# EAGLE design ARE_entrenadora_revisada (EAGLE 5.10)
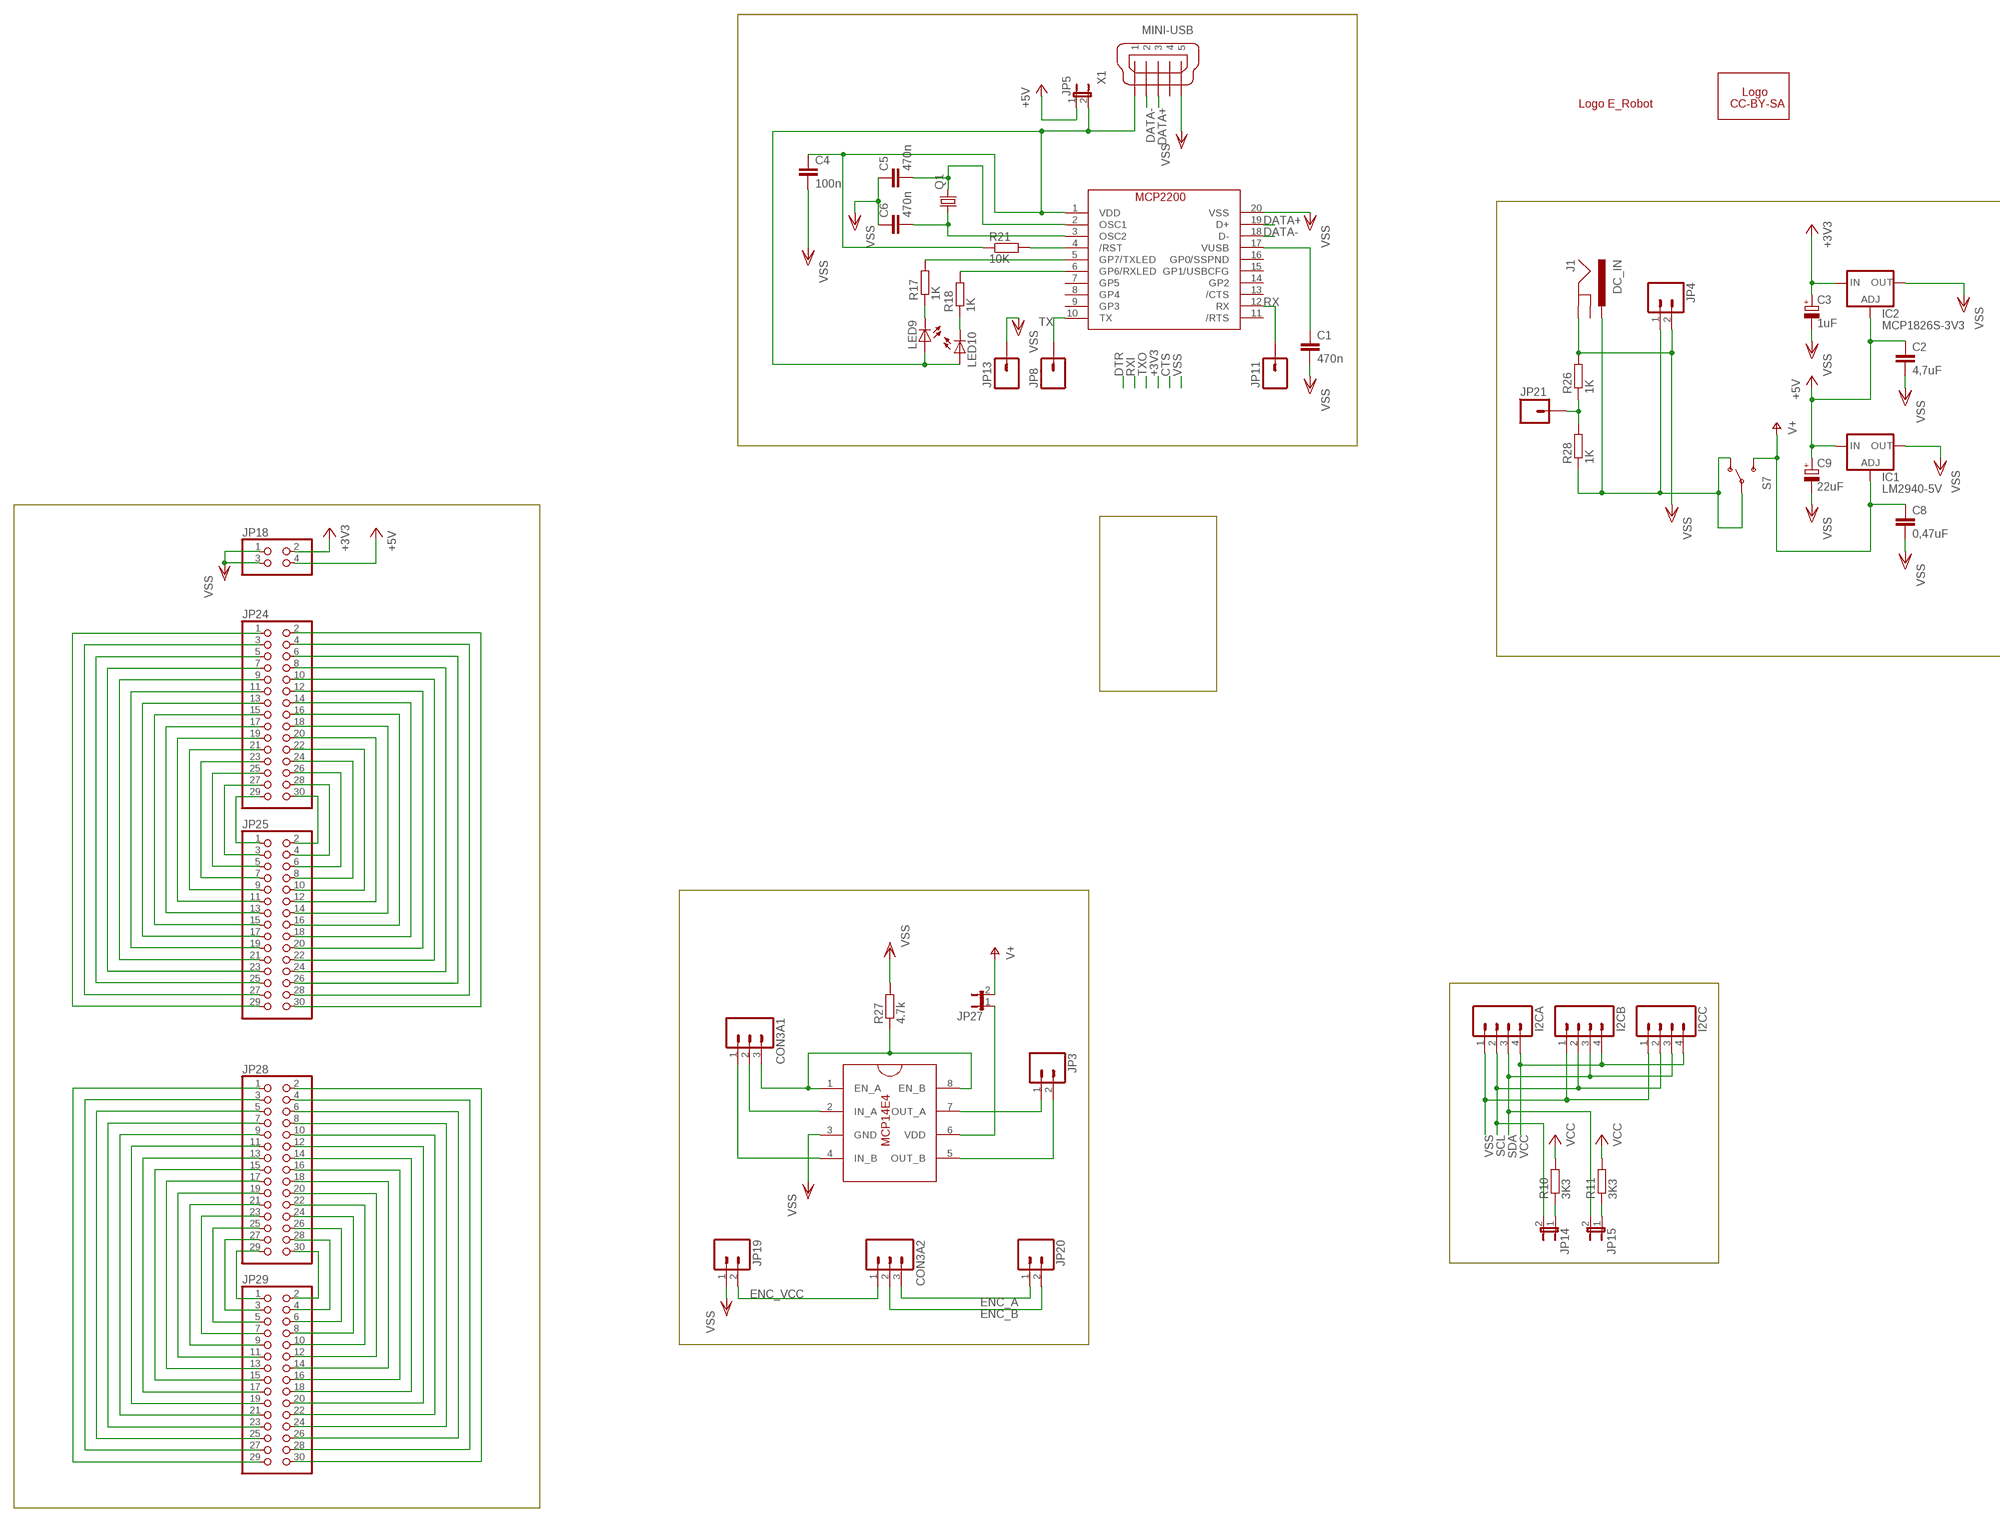
[diagram p0: schematic, sheet 1, part 1 of 2]
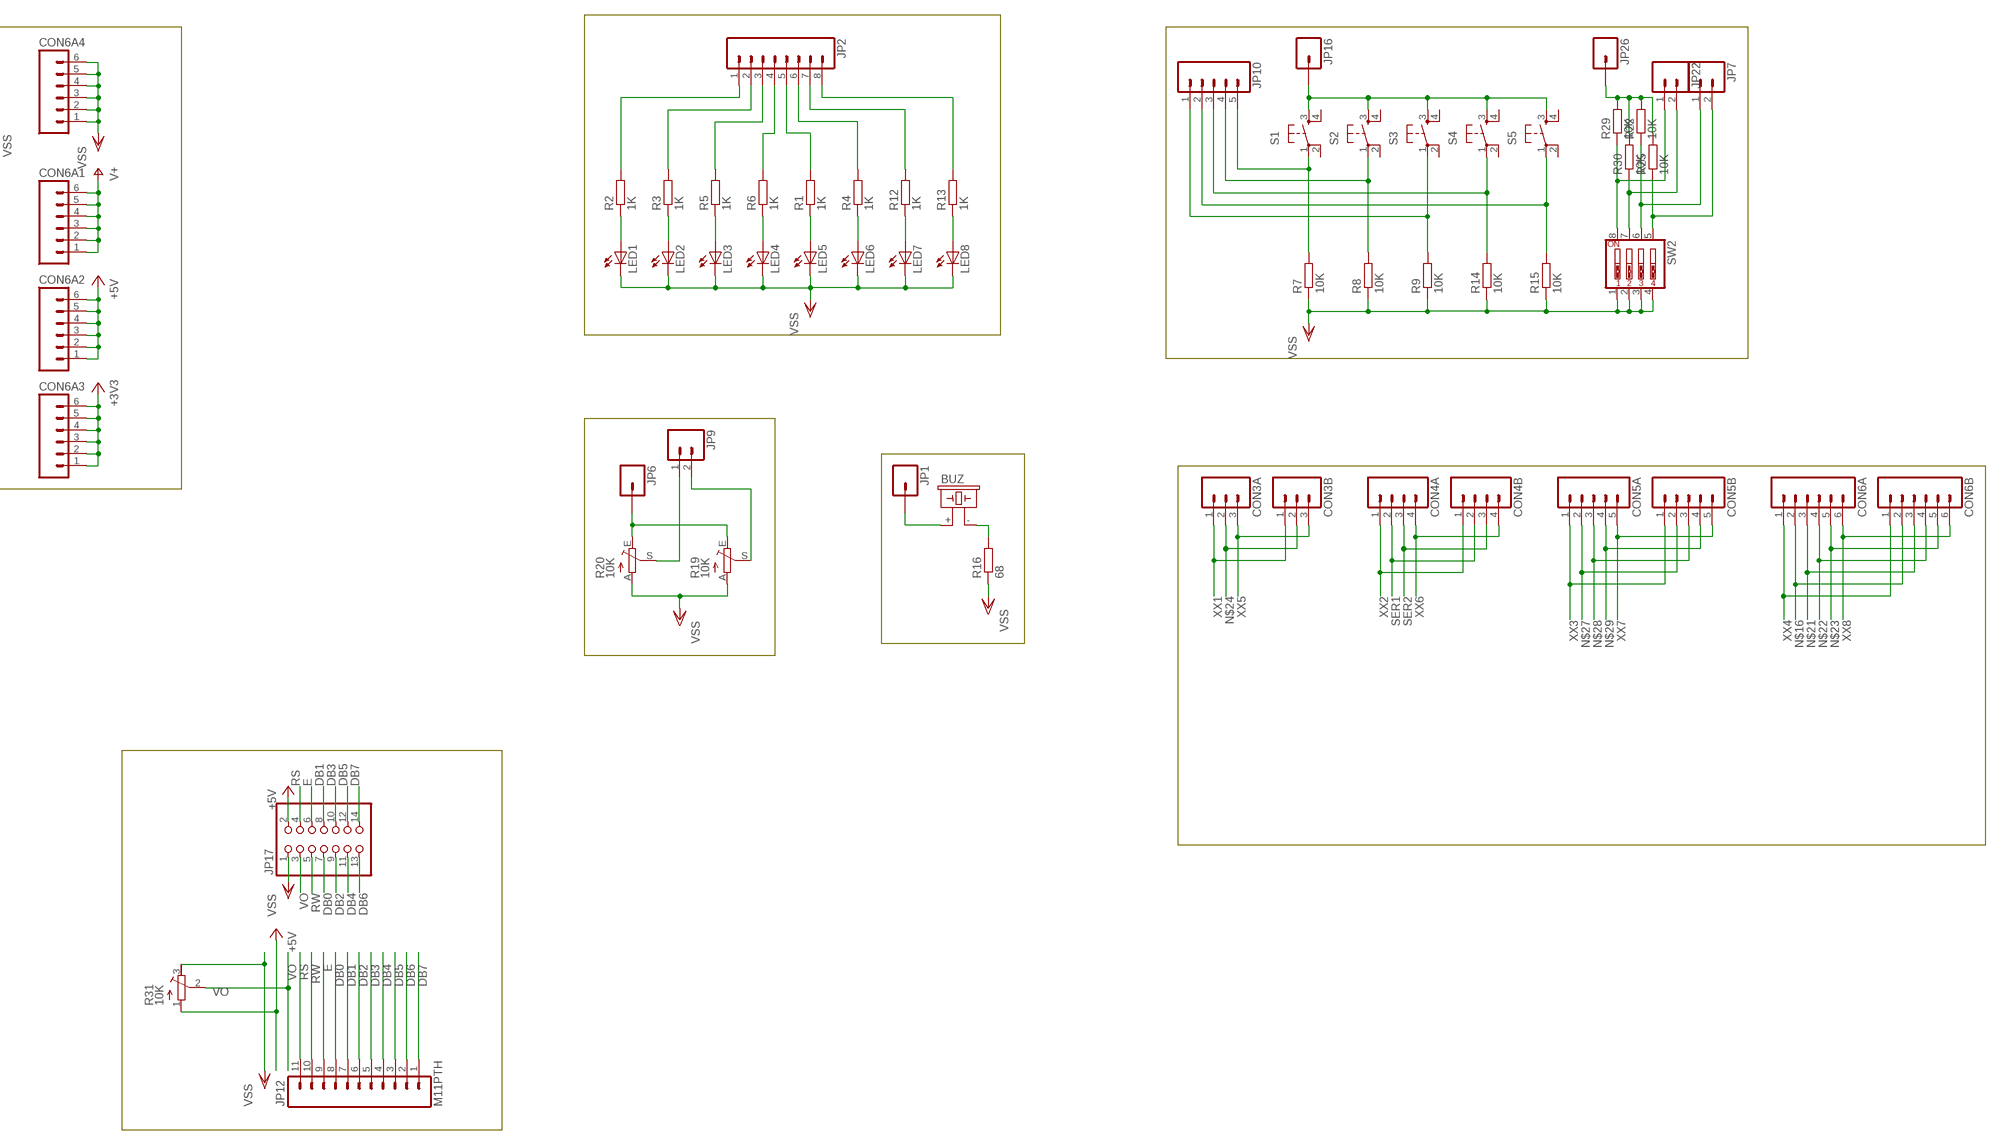
[diagram p1: schematic, sheet 1, part 2 of 2]

## Parts
BUZ  F/CM12P  [F/CM12P]
C1  470n  C-EUC0805  [C0805]
C2  4,7uF  C-EU025-025X050  [C025-025X050]
C3  1uF  CPOL-EUE2,5-6E  [E2,5-6E]
C4  100n  C-EUC0805  [C0805]
C5  470n  C-EUC0805  [C0805]
C6  470n  C-EUC0805  [C0805]
C8  0,47uF  C-EU025-025X050  [C025-025X050]
C9  22uF  CPOL-EUE2,5-6E  [E2,5-6E]
CON3A  M03PTH  [1X03]
CON3A1  M03PTH  [1X03]
CON3A2  M03PTH  [1X03]
CON3B  M03PTH  [1X03]
CON4A  M04PTH  [1X04]
CON4B  M04PTH  [1X04]
CON5A  M05PTH  [1X05]
CON5B  M05PTH  [1X05]
CON6A  M06SIP  [1X06]
CON6A1  M06SIP  [1X06]
CON6A2  M06SIP  [1X06]
CON6A3  M06SIP  [1X06]
CON6A4  M06SIP  [1X06]
CON6B  M06SIP  [1X06]
I2CA  M04PTH  [1X04]
I2CB  M04PTH  [1X04]
I2CC  M04PTH  [1X04]
IC1  LM2940-5V  LM317BD2T  [D2PACK]
IC2  MCP1826S-3V3  LM317BD2T  [D2PACK]
J1  DC_IN  POWER_JACKPTH  [POWER_JACK_PTH]
JP1  M01PTH  [1X01]
JP2  M08  [1X08]
JP3  M02PTH  [1X02]
JP4  M02PTH  [1X02]
JP5  JUMPER-2PTH  [1X02]
JP6  M01PTH  [1X01]
JP7  M02PTH  [1X02]
JP8  M01PTH  [1X01]
JP9  M02PTH  [1X02]
JP10  M05PTH  [1X05]
JP11  M01PTH  [1X01]
JP12  M11PTH  [1X11]
JP13  M01PTH  [1X01]
JP14  JUMPER-2PTH  [1X02]
JP15  JUMPER-2PTH  [1X02]
JP16  M01PTH  [1X01]
JP17  PINHD-2X7  [2X07]
JP18  PINHD-2X2  [2X02]
JP19  M02PTH  [1X02]
JP20  M02PTH  [1X02]
JP21  M01PTH  [1X01]
JP22  M02PTH  [1X02]
JP24  PINHD-2X15  [2X15]
JP25  PINHD-2X15  [2X15]
JP26  M01PTH  [1X01]
JP27  JUMPER-2PTH  [1X02]
JP28  PINHD-2X15  [2X15]
JP29  PINHD-2X15  [2X15]
LED1  LED3MM  [LED3MM]
LED2  LED3MM  [LED3MM]
LED3  LED3MM  [LED3MM]
LED4  LED3MM  [LED3MM]
LED5  LED3MM  [LED3MM]
LED6  LED3MM  [LED3MM]
LED7  LED3MM  [LED3MM]
LED8  LED3MM  [LED3MM]
LED9  LEDCHIPLED_0805  [CHIPLED_0805]
LED10  LEDCHIPLED_0805  [CHIPLED_0805]
Q1  CRYSTALHC18U-V  [HC18U-V]
R1  1K  R-EU_R0805  [R0805]
R2  1K  R-EU_R0805  [R0805]
R3  1K  R-EU_R0805  [R0805]
R4  1K  R-EU_R0805  [R0805]
R5  1K  R-EU_R0805  [R0805]
R6  1K  R-EU_R0805  [R0805]
R7  10K  R-EU_R0805  [R0805]
R8  10K  R-EU_R0805  [R0805]
R9  10K  R-EU_R0805  [R0805]
R10  3K3  R-EU_R0805  [R0805]
R11  3K3  R-EU_R0805  [R0805]
R12  1K  R-EU_R0805  [R0805]
R13  1K  R-EU_R0805  [R0805]
R14  10K  R-EU_R0805  [R0805]
R15  10K  R-EU_R0805  [R0805]
R16  68  R-EU_R0805  [R0805]
R17  1K  R-EU_R0805  [R0805]
R18  1K  R-EU_R0805  [R0805]
R19  10K  TRIM_EU-CA6V  [CA6V]
R20  10K  TRIM_EU-CA6V  [CA6V]
R21  10K  R-EU_R0805  [R0805]
R22  10K  R-EU_R0805  [R0805]
R25  10K  R-EU_R0805  [R0805]
R26  1K  R-EU_R0805  [R0805]
R27  4.7k  R-EU_R0805  [R0805]
R28  1K  R-EU_R0805  [R0805]
R29  10K  R-EU_R0805  [R0805]
R30  10K  R-EU_R0805  [R0805]
R31  10K  R-TRIMM4G/J  [RTRIM4G/J]
S1  TAC_SWITCHPTH  [TACTILE-PTH]
S2  TAC_SWITCHPTH  [TACTILE-PTH]
S3  TAC_SWITCHPTH  [TACTILE-PTH]
S4  TAC_SWITCHPTH  [TACTILE-PTH]
S5  TAC_SWITCHPTH  [TACTILE-PTH]
S7  SWITCH-SPSTSMD2  [SWITCH-SPDT-SMD]
SW2  SW_DIP-4  [EDG-04]
U$1  LOGO_BY-SA  [LOGO_CC-BY-SA]
U$4  MCP14E4P  [DIL8]
U$5  LOGO_E_ROBOTGRANDE_BUTON  [GRANDE]
U$6  MCP2200SO  [SO-20W]
X1  MINI-USB  MINI-USB-32005-201  [32005-201]

## Nets
+3V3: C3.+ CON6A3.1 CON6A3.2 CON6A3.3 CON6A3.4 CON6A3.5 CON6A3.6 IC2.3(IN) JP18.2
+5V: C2.1 C9.+ CON6A2.1 CON6A2.2 CON6A2.3 CON6A2.4 CON6A2.5 CON6A2.6 IC1.3(IN) IC2.1(ADJ) JP5.1 JP17.2 JP18.4 R31.1(E)
DATA+: U$6.19(D+) X1.3
DATA-: U$6.18(D-) X1.2
DB0: JP12.8 JP17.7
DB1: JP12.7 JP17.8
DB2: JP12.6 JP17.9
DB3: JP12.5 JP17.10
DB4: JP12.4 JP17.11
DB5: JP12.3 JP17.12
DB6: JP12.2 JP17.13
DB7: JP12.1 JP17.14
E: JP12.9 JP17.6
ENC_A: CON3A2.3 JP20.1
ENC_B: CON3A2.2 JP20.2
ENC_VCC: CON3A2.1 JP19.2
N$1: LED3.A R5.1
N$2: LED2.A R3.1
N$3: LED1.A R2.1
N$4: LED4.A R6.1
N$5: JP2.2 R3.2
N$6: JP2.3 R5.2
N$7: JP2.1 R2.2
N$8: JP2.4 R6.2
N$9: LED9.C R17.1
N$10: JP10.5 R7.2 S1.1
N$11: JP10.4 R8.2 S2.1
N$12: JP10.3 R14.2 S4.1
N$13: JP14.1 R10.1
N$14: JP15.1 R11.1
N$15: JP6.1 R19.E R20.E
N$16: CON6A.2 CON6B.2
N$17: BUZ.- R16.2
N$18: C6.2 Q1.1 U$6.3(OSC2)
N$19: C5.2 Q1.2 U$6.2(OSC1)
N$20: LED10.C R18.1
N$21: CON6A.3 CON6B.3
N$22: CON6A.4 CON6B.4
N$23: CON6A.5 CON6B.5
N$24: CON3A.2 CON3B.2
N$25: C4.1 JP5.2 LED9.A LED10.A R21.1 U$6.1(VDD) X1.1
N$26: JP16.1 S1.3 S2.3 S3.3 S4.3 S5.3
N$27: CON5A.2 CON5B.2
N$28: CON5A.3 CON5B.3
N$29: CON5A.4 CON5B.4
N$30: JP28.29 JP29.1
N$31: JP28.27 JP29.3
N$32: JP28.25 JP29.5
N$33: JP28.23 JP29.7
N$34: JP28.21 JP29.9
N$35: JP28.19 JP29.11
N$36: JP28.17 JP29.13
N$37: JP28.15 JP29.15
N$38: JP28.13 JP29.17
N$39: JP28.11 JP29.19
N$40: JP28.9 JP29.21
N$41: JP28.7 JP29.23
N$42: JP28.5 JP29.25
N$43: JP28.3 JP29.27
N$44: JP26.1 R22.2 R25.2 R29.2 R30.2
N$45: J1.PWR JP4.1 R28.1 S7.1(O) S7.2(P)
N$46: JP28.30 JP29.2
N$47: JP28.28 JP29.4
N$48: JP28.26 JP29.6
N$49: JP28.24 JP29.8
N$50: R17.2 U$6.5(GP7/TXLED)
N$51: R18.2 U$6.6(GP6/RXLED)
N$52: C1.1 U$6.17(VUSB)
N$53: JP9.1 R20.S
N$54: JP9.2 R19.S
N$55: JP3.1 U$4.7(OUT_A)
N$56: R21.2 U$6.4(/RST)
N$57: JP21.1 R26.1 R28.2
N$58: LED6.A R4.1
N$59: LED5.A R1.1
N$60: LED7.A R12.1
N$61: LED8.A R13.1
N$62: JP2.6 R4.2
N$63: JP2.7 R12.2
N$64: JP2.5 R1.2
N$65: JP2.8 R13.2
N$66: JP10.2 R15.2 S5.1
N$67: JP10.1 R9.2 S3.1
N$68: JP27.1 U$4.6(VDD)
N$69: JP7.2 R25.1 SW2.5
N$70: JP7.1 R22.1 SW2.6
N$71: JP28.1 JP29.29
N$72: JP28.2 JP29.30
N$82: JP28.22 JP29.10
N$83: BUZ.+ JP1.1
N$85: JP28.20 JP29.12
N$86: JP28.18 JP29.14
N$87: JP28.16 JP29.16
N$88: JP28.14 JP29.18
N$89: JP28.12 JP29.20
N$90: JP28.10 JP29.22
N$91: JP28.8 JP29.24
N$92: JP28.6 JP29.26
N$93: JP28.4 JP29.28
N$96: JP24.30 JP25.2
N$97: JP24.28 JP25.4
N$98: JP24.26 JP25.6
N$99: JP24.24 JP25.8
N$100: JP24.22 JP25.10
N$101: JP24.20 JP25.12
N$102: JP24.18 JP25.14
N$103: JP24.16 JP25.16
N$104: JP24.14 JP25.18
N$105: JP24.12 JP25.20
N$106: JP24.10 JP25.22
N$107: JP24.8 JP25.24
N$108: JP24.6 JP25.26
N$109: JP24.4 JP25.28
N$110: JP24.2 JP25.30
N$112: JP24.29 JP25.1
N$113: JP24.27 JP25.3
N$114: JP24.25 JP25.5
N$115: JP24.23 JP25.7
N$116: JP24.21 JP25.9
N$117: JP24.19 JP25.11
N$118: JP24.17 JP25.13
N$119: JP24.15 JP25.15
N$120: JP24.13 JP25.17
N$121: JP24.11 JP25.19
N$122: JP24.9 JP25.21
N$123: JP24.7 JP25.23
N$124: JP24.5 JP25.25
N$125: JP24.3 JP25.27
N$126: JP24.1 JP25.29
N$128: JP3.2 U$4.5(OUT_B)
N$129: CON3A1.3 R27.1 U$4.1(EN_A) U$4.8(EN_B)
N$130: CON3A1.2 U$4.2(IN_A)
N$131: CON3A1.1 U$4.4(IN_B)
N$133: JP22.1 R29.1 SW2.8
N$136: JP22.2 R30.1 SW2.7
RS: JP12.11 JP17.4
RW: JP12.10 JP17.5
RX: JP11.1 U$6.12(RX)
SCL: I2CA.2 I2CB.2 I2CC.2 JP14.2
SDA: I2CA.3 I2CB.3 I2CC.3 JP15.2
SER1: CON4A.2 CON4B.2
SER2: CON4A.3 CON4B.3
TX: JP8.1 U$6.10(TX)
V+: C8.1 CON6A1.1 CON6A1.2 CON6A1.3 CON6A1.4 CON6A1.5 CON6A1.6 IC1.1(ADJ) JP27.2 S7.3(S)
VCC: I2CA.4 I2CB.4 I2CC.4 R10.2 R11.2
VO: JP17.3 R31.2(S)
VSS: C1.2 C2.2 C3.- C4.2 C5.1 C6.1 C8.2 C9.- CON6A4.1 CON6A4.2 CON6A4.3 CON6A4.4 CON6A4.5 CON6A4.6 I2CA.1 I2CB.1 I2CC.1 IC1.2(OUT) IC2.2(OUT) J1.GND JP4.2 JP13.1 JP17.1 JP18.1 JP18.3 JP19.1 LED1.K(C) LED2.K(C) LED3.K(C) LED4.K(C) LED5.K(C) LED6.K(C) LED7.K(C) LED8.K(C) R7.1 R8.1 R9.1 R14.1 R15.1 R16.1 R19.A R20.A R26.2 R27.2 R31.3(A) SW2.1 SW2.2 SW2.3 SW2.4 U$4.3(GND) U$6.20(VSS) X1.5
XX1: CON3A.1 CON3B.1
XX2: CON4A.1 CON4B.1
XX3: CON5A.1 CON5B.1
XX4: CON6A.1 CON6B.1
XX5: CON3A.3 CON3B.3
XX6: CON4A.4 CON4B.4
XX7: CON5A.5 CON5B.5
XX8: CON6A.6 CON6B.6
Unconnected: J1.GNDBREAK S1.2 S1.4 S2.2 S2.4 S3.2 S3.4 S4.2 S4.4 S5.2 S5.4 U$6.7(GP5) U$6.8(GP4) U$6.9(GP3) U$6.11(/RTS) U$6.13(/CTS) U$6.14(GP2) U$6.15(GP1/USBCFG) U$6.16(GP0/SSPND) X1.4

## Library data of the parts
BUZ = buzzer:F/CM12P: BUZZER Source: Buerklin
C1 C2 C4-C6 C8 = rcl:C-EU: CAPACITOR, European symbol
C3 C9 = rcl:CPOL-EU: POLARIZED CAPACITOR, European symbol
CON3A CON3A1 CON3A2 CON3B = SparkFun:M03: Header 3 Standard 3-pin 0.1" header. Use with straight break away headers (SKU : PRT-00116), right angle break away headers (PRT-00553), swiss pins (PRT-00743), machine pins (PRT-00117), and female headers (PRT-00115). Molex polarized connector foot print use with SKU : PRT-08232 with associated crimp pins and housings.
CON4A CON4B I2CA I2CB I2CC = SparkFun:M04: Header 4 Standard 4-pin 0.1" header. Use with straight break away headers (SKU : PRT-00116), right angle break away headers (PRT-00553), swiss pins (PRT-00743), machine pins (PRT-00117), and female headers (PRT-00115). Molex polarized connector foot print use with SKU : PRT-08231 with associated crimp pins and housings. 1MM SMD Version SKU: PRT-10208
CON5A CON5B JP10 = SparkFun:M05: Header 5 Standard 5-pin 0.1" header. Use with straight break away headers (SKU : PRT-00116), right angle break away headers (PRT-00553), swiss pins (PRT-00743), machine pins (PRT-00117), and female headers (PRT-00115). Molex polarized connector foot print use with SKU : PRT-08230 with associated crimp pins and housings.
CON6A CON6A1-CON6A4 CON6B = SparkFun:M06: Header 6 Standard 6-pin 0.1" header. Use with straight break away headers (SKU : PRT-00116), right angle break away headers (PRT-00553), swiss pins (PRT-00743), machine pins (PRT-00117), and female headers (PRT-00115). Molex polarized connector foot print use with SKU : PRT-08094 with associated crimp pins and housings. NOTES ON THE VARIANTS LOCK and LOCK_LONGPADS... This footprint was designed to help hold the alignment of a through-hole component (i.e. 6-pin header) while soldering it into place. You may notice that each hole has been shifted either up or down by 0.005 of an inch from it's more standard position (which is a perfectly straight line). This slight alteration caused the pins (the squares in the middle) to touch the edges of the holes. Because they are alternating, it causes a "brace" to hold the component in place. 0.005 has proven to be the perfect amount of "off-center" position when using our standard breakaway headers. Although looks a little odd when you look at the bare footprint, once you have a header in there, the alteration is very hard to notice. Also, if you push a header all the way into place, it is covered up entirely on the bottom side. This idea of altering the position of holes to aid alignment will be further integrated into the Sparkfun Library for other footprints. It can help hold any component with 3 or more connection pins.
IC1 IC2 = v-reg:LM317?*: 500 mA Adjustable Output Positive Voltage Regulator Source: http://www.onsemi.co.jp .. LM317M-D.PDF
J1 = SparkFun:POWER_JACK: Power Jack This is the standard 5.5mm barrel jack for power. The PTH is the most common, proven, reliable, footprint. All others are experimental. The Slot footprint only works if the mill layer is transmitted to the PCB fab house so be warned. Spark Fun Electronics SKU : PRT-00119. Mating wall wart : TOL-00298 (and others)
JP1 JP6 JP8 JP11 JP13 JP16 JP21 JP26 = SparkFun:M01: Header 1 Standard 1-pin 0.1" header. Use with straight break away headers (SKU : PRT-00116), right angle break away headers (PRT-00553), swiss pins (PRT-00743), machine pins (PRT-00117), and female headers (PRT-00115).
JP2 = SparkFun:M08: Header 8 Standard 8-pin 0.1" header. Use with straight break away headers (SKU : PRT-00116), right angle break away headers (PRT-00553), swiss pins (PRT-00743), machine pins (PRT-00117), and female headers (PRT-00115).
JP3 JP4 JP7 JP9 JP19 JP20 JP22 = SparkFun:M02: Header 2 Standard 2-pin 0.1" header. Use with straight break away headers (SKU : PRT-00116), right angle break away headers (PRT-00553), swiss pins (PRT-00743), machine pins (PRT-00117), and female headers (PRT-00115). Molex polarized connector foot print use with SKU : PRT-08233 with associated crimp pins and housings.
JP5 JP14 JP15 JP27 = SparkFun:JUMPER-2: Jumper Basic 0.1" spaced jumper. Use with breakaway headers.
JP12 = SparkFun:M11: Header 11 Standard 11-pin 0.1" header. Use with straight break away headers (SKU : PRT-00116), right angle break away headers (PRT-00553), swiss pins (PRT-00743), machine pins (PRT-00117), and female headers (PRT-00115).
JP17 = pinhead:PINHD-2X7: PIN HEADER
JP18 = pinhead:PINHD-2X2: PIN HEADER
JP24 JP25 JP28 JP29 = pinhead:PINHD-2X15: PIN HEADER
LED1-LED10 = led:LED: LED OSRAM: - CHIPLED LG R971, LG N971, LY N971, LG Q971, LY Q971, LO R971, LY R971 LH N974, LH R974 LS Q976, LO Q976, LY Q976 LO Q996 - Hyper CHIPLED LW Q18S LB Q993, LB Q99A, LB R99A - SideLED LS A670, LO A670, LY A670, LG A670, LP A670 LB A673, LV A673, LT A673, LW A673 LH A674 LY A675 LS A676, LA A676, LO A676, LY A676, LW A676 LS A679, LY A679, LG A679 - Hyper Micro SIDELED® LS Y876, LA Y876, LO Y876, LY Y876 LT Y87S - SmartLED LW L88C, LW L88S LB L89C, LB L89S, LG L890 LS L89K, LO L89K, LY L89K LS L896, LA L896, LO L896, LY L896 - TOPLED LS T670, LO T670, LY T670, LG T670, LP T670 LSG T670, LSP T670, LSY T670, LOP T670, LYG T670 LG T671, LOG T671, LSG T671 LB T673, LV T673, LT T673, LW T673 LH T674 LS T676, LA T676, LO T676, LY T676, LB T676, LH T676, LSB T676, LW T676 LB T67C, LV T67C, LT T67C, LS T67K, LO T67K, LY T67K, LW E67C LS E67B, LA E67B, LO E67B, LY E67B, LB E67C, LV E67C, LT E67C LW T67C LS T679, LY T679, LG T679 LS T770, LO T770, LY T770, LG T770, LP T770 LB T773, LV T773, LT T773, LW T773 LH T774 LS E675, LA E675, LY E675, LS T675 LS T776, LA T776, LO T776, LY T776, LB T776 LHGB T686 LT T68C, LB T68C - Hyper Mini TOPLED® LB M676 - Mini TOPLED Santana® LG M470 LS M47K, LO M47K, LY M47K Source: http://www.osram.convergy.de LUXEON: - LUMILED® LXK2-PW12-R00, LXK2-PW12-S00, LXK2-PW14-U00, LXK2-PW14-V00 LXK2-PM12-R00, LXK2-PM12-S00, LXK2-PM14-U00 LXK2-PE12-Q00, LXK2-PE12-R00, LXK2-PE12-S00, LXK2-PE14-T00, LXK2-PE14-U00 LXK2-PB12-K00, LXK2-PB12-L00, LXK2-PB12-M00, LXK2-PB14-N00, LXK2-PB14-P00, LXK2-PB14-Q00 LXK2-PR12-L00, LXK2-PR12-M00, LXK2-PR14-Q00, LXK2-PR14-R00 LXK2-PD12-Q00, LXK2-PD12-R00, LXK2-PD12-S00 LXK2-PH12-R00, LXK2-PH12-S00 LXK2-PL12-P00, LXK2-PL12-Q00, LXK2-PL12-R00 Source: www.luxeon.com KINGBRIGHT: KA-3528ASYC Source: www.kingbright.com
Q1 = crystal:CRYSTAL: CRYSTAL
R1-R18 R21 R22 R25-R30 = rcl:R-EU_: RESISTOR, European symbol
R19 R20 = pot:TRIM_EU-: POTENTIOMETER
R31 = resistor:R-TRIMM: Trimm resistor
S1-S5 = SparkFun:TAC_SWITCH: Momentary Switch Button commonly used for reset or general input. Spark Fun Electronics SKU : COM-00097
S7 = SparkFun:SWITCH-SPST: SPST Switch Simple slide switch. Spark Fun Electronics SKU : COM-00102
SW2 = special:SW_DIP-4: DIP SWITCH
U$1 = ARE_logos:LOGO_BY-SA
U$4 = microchip_nuevo:MCP14E4
U$5 = Logos:LOGO_E_ROBOT
U$6 = microchip_nuevo:MCP2200
X1 = con-cypressindustries:MINI-USB-: MINI USB-B Conector Source: www.cypressindustries.com

## Board
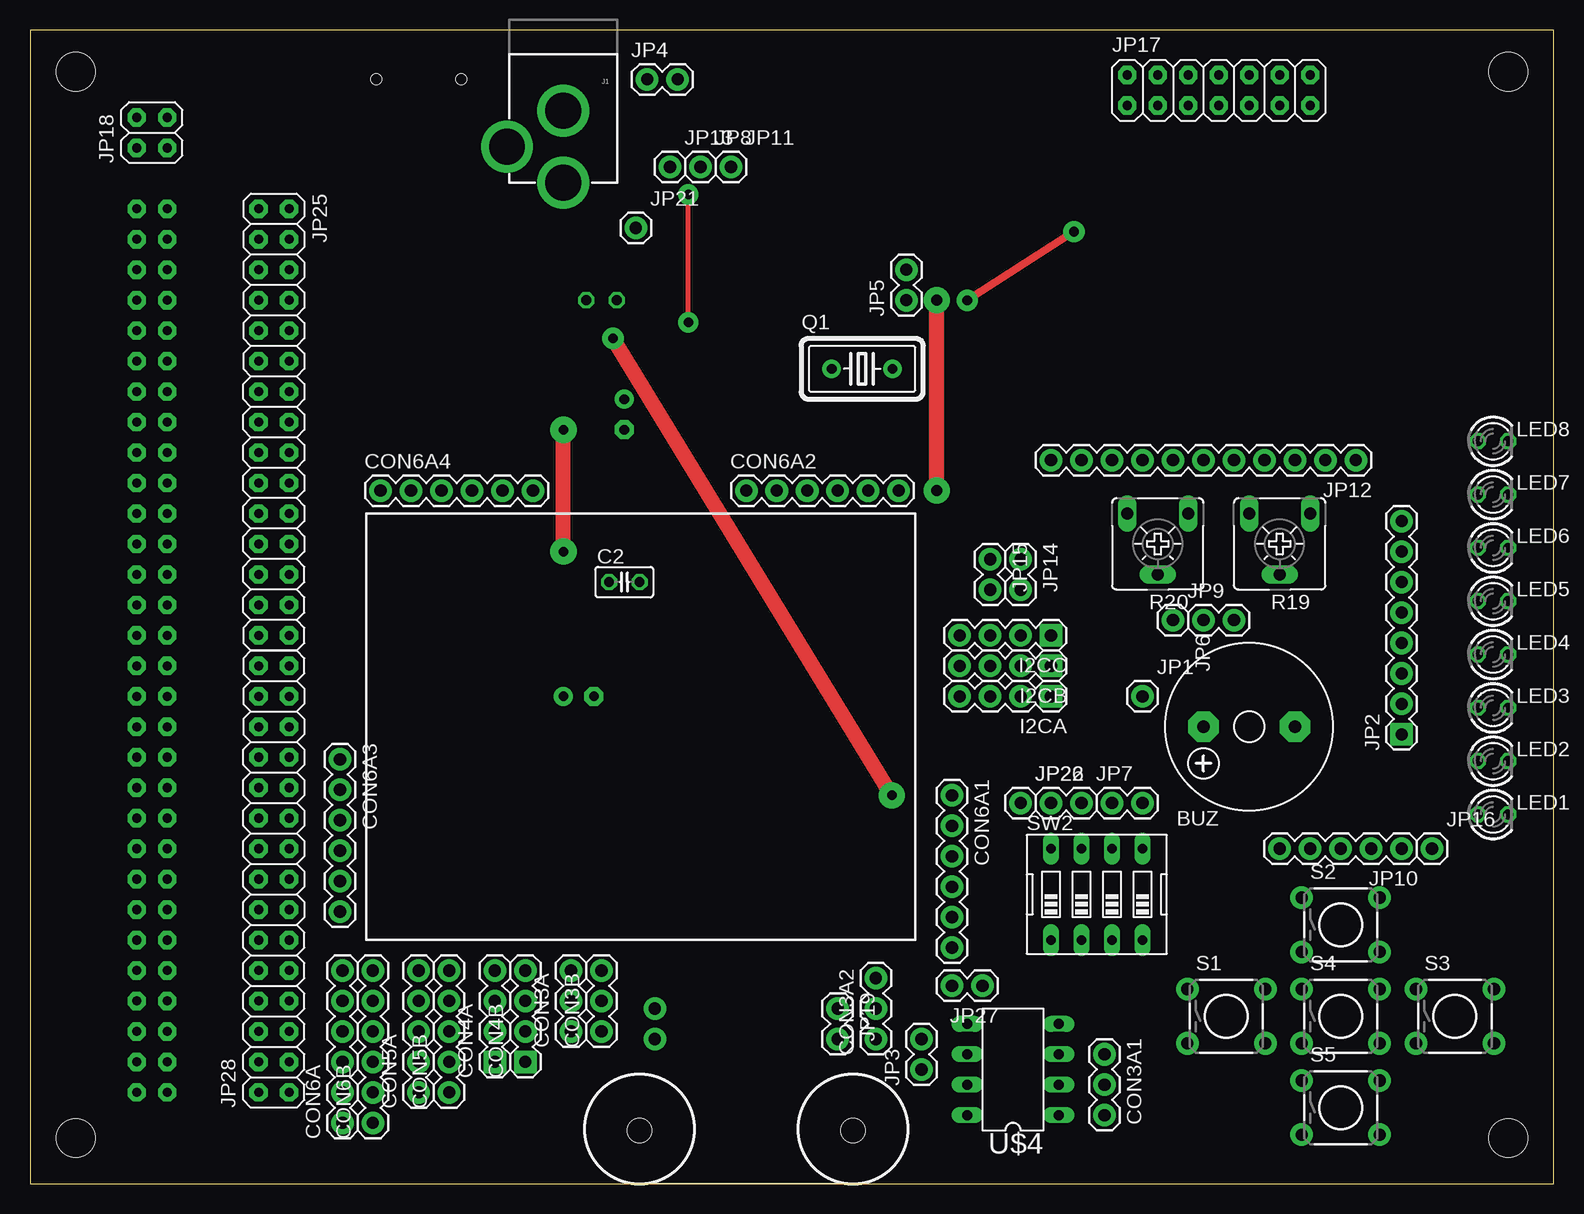
[diagram p2: board, top side]
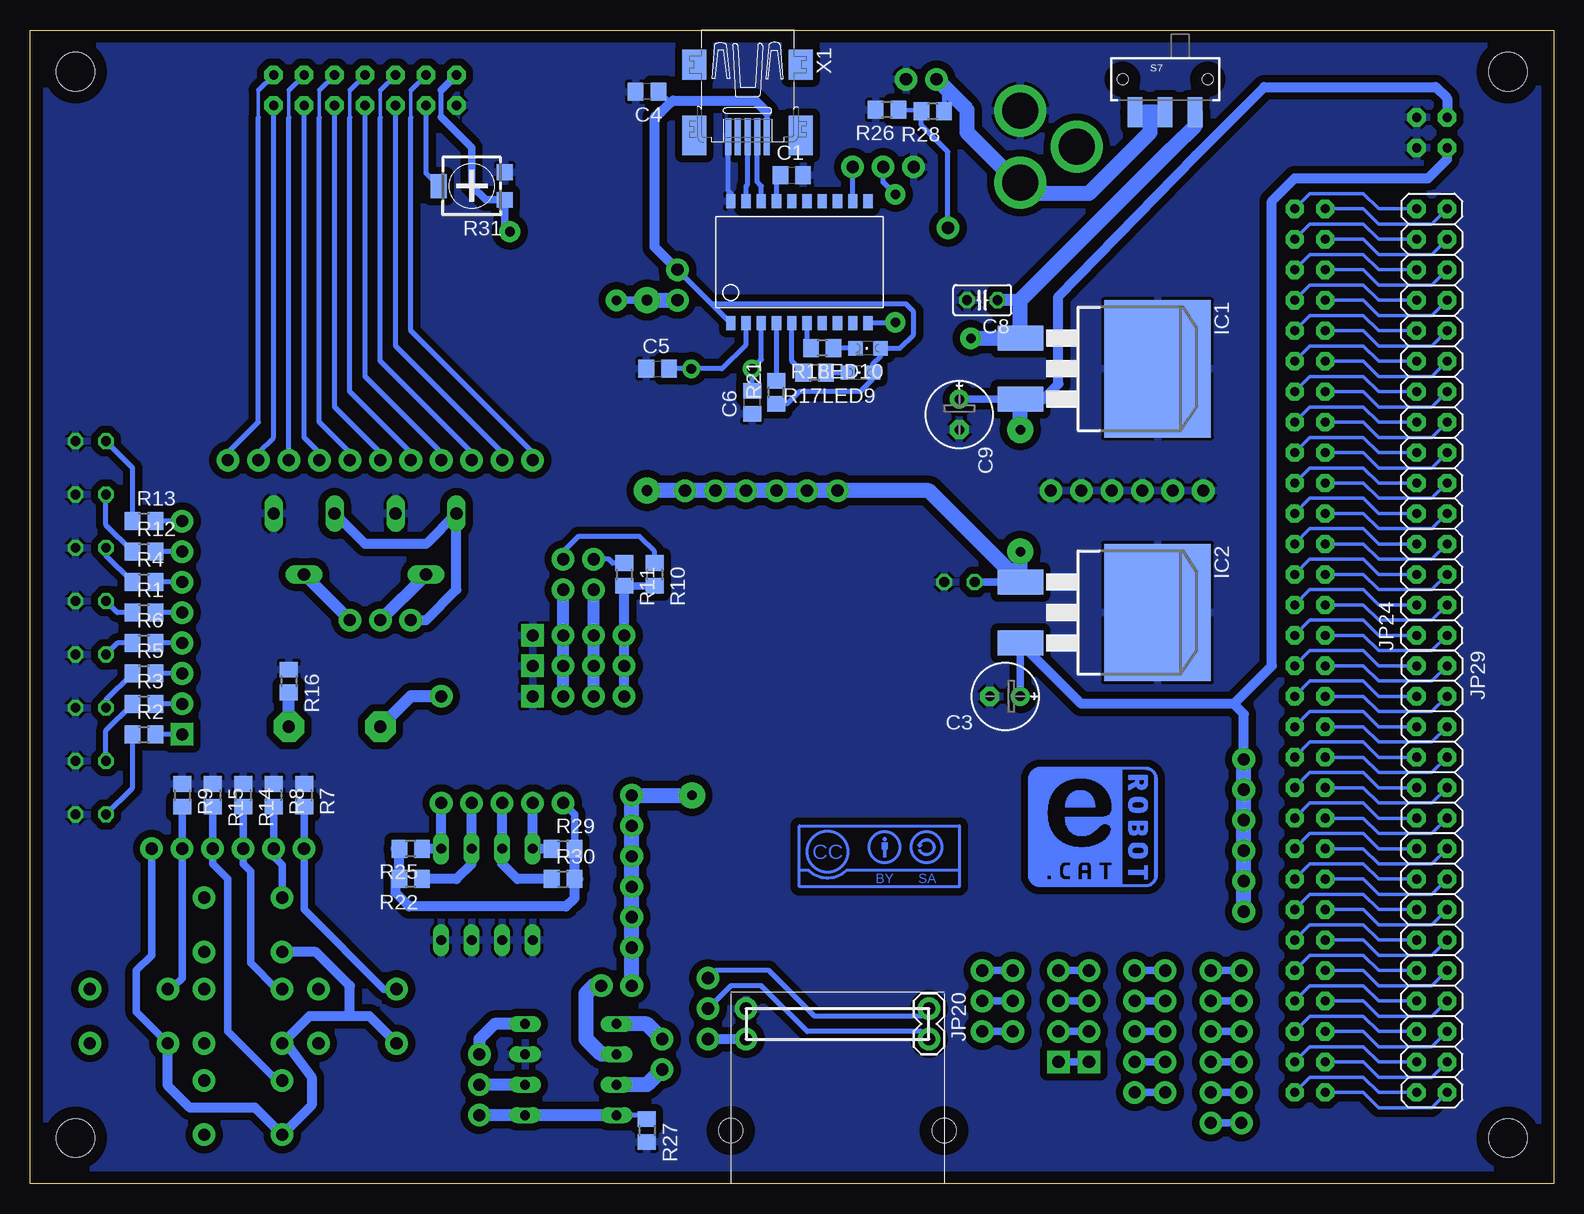
[diagram p3: board, bottom side, seen from below]

Size 126.98 x 96.19 mm. Coordinates in mm from the lower left corner, seen from the top.
Outline: 0,0 126.98,0 126.98,96.19 0,96.19 0,0
Copper layers (1*16): Top 0.035mm / dielectric 1.5mm / Bottom 0.035mm
Design rules "default": minimum track width 10mil, minimum drill 24mil, track to track 8mil, track to pad 8mil, pad to pad 8mil, via to via 8mil, smd to smd 8mil, copper to edge 40mil, drill to drill 8mil, minimum pad ring 10mil, minimum via ring 8mil, stop-mask expansion 4mil, vias tented up to drill 0mil, thermal gap 10mil
Holes 2 mm at 50.8,4.45 68.58,4.45
Holes 3.2 mm at 123.19,3.81 3.81,3.81 3.81,92.71 123.19,92.71

### Footprints (pad centres in the part's own frame; a part is rotated, then mirrored left to right if it is on the bottom)
F/CM12P = drill 1.016 pad 2.54 octagon: + 3.81,0; - -3.81,0
C0805 = smd 1.3 x 1.5: 1 -0.95,0; 2 0.95,0
C025-025X050 = drill 0.813 octagon: 1 -1.27,0; 2 1.27,0
E2,5-6E = drill 0.813 pad 1.575 round: + -1.27,0 | drill 0.813 pad 1.575 octagon: - 1.27,0
1X03 = drill 1.016 pad 1.88 round: 1 0,0; 2 2.54,0; 3 5.08,0
1X04 = drill 1.016 pad 1.88 square: 1 0,0 | drill 1.016 pad 1.88 round: 2 2.54,0; 3 5.08,0; 4 7.62,0
1X05 = drill 1.016 pad 1.88 round: 1 0,0; 2 2.54,0; 3 5.08,0; 4 7.62,0; 5 10.16,0
1X06 = drill 1.016 pad 1.88 round: 1 0,0; 2 2.54,0; 3 5.08,0; 4 7.62,0; 5 10.16,0; 6 12.7,0
D2PACK = smd 2.083 x 3.81: 1 -2.54,-8.89; 3 2.54,-8.89 | smd 11.43 x 8.89: 2 0,2.54
POWER_JACK_PTH = drill 2.997 pad 4.318 round: GND 0,7.7; GNDBREAK 4.7,10.7; PWR 0,13.7
1X01 = drill 1.016 pad 1.88 round: 1 0,0
1X08 = drill 1.016 pad 1.88 square: 1 0,0 | drill 1.016 pad 1.88 round: 2 2.54,0; 3 5.08,0; 4 7.62,0; 5 10.16,0; 6 12.7,0; 7 15.24,0; 8 17.78,0
1X02 = drill 1.016 pad 1.88 round: 1 0,0; 2 2.54,0
1X11 = drill 1.016 pad 1.88 round: 1 0,0; 2 2.54,0; 3 5.08,0; 4 7.62,0; 5 10.16,0; 6 12.7,0; 7 15.24,0; 8 17.78,0; 9 20.32,0; 10 22.86,0; 11 25.4,0
2X07 = drill 0.762 pad 1.524 octagon: 1 -7.62,-1.27; 2 -7.62,1.27; 3 -5.08,-1.27; 4 -5.08,1.27; 5 -2.54,-1.27; 6 -2.54,1.27; 7 0,-1.27; 8 0,1.27; 9 2.54,-1.27; 10 2.54,1.27; 11 5.08,-1.27; 12 5.08,1.27; 13 7.62,-1.27; 14 7.62,1.27
2X02 = drill 0.762 pad 1.524 octagon: 1 -1.27,-1.27; 2 -1.27,1.27; 3 1.27,-1.27; 4 1.27,1.27
2X15 = drill 0.762 pad 1.524 octagon: 1 -17.78,-1.27; 2 -17.78,1.27; 3 -15.24,-1.27; 4 -15.24,1.27; 5 -12.7,-1.27; 6 -12.7,1.27; 7 -10.16,-1.27; 8 -10.16,1.27; 9 -7.62,-1.27; 10 -7.62,1.27; 11 -5.08,-1.27; 12 -5.08,1.27; 13 -2.54,-1.27; 14 -2.54,1.27; 15 0,-1.27; 16 0,1.27; 17 2.54,-1.27; 18 2.54,1.27; 19 5.08,-1.27; 20 5.08,1.27; 21 7.62,-1.27; 22 7.62,1.27; 23 10.16,-1.27; 24 10.16,1.27; 25 12.7,-1.27; 26 12.7,1.27; 27 15.24,-1.27; 28 15.24,1.27; 29 17.78,-1.27; 30 17.78,1.27
LED3MM = drill 0.813 octagon: A -1.27,0; K 1.27,0
CHIPLED_0805 = smd 1.2 x 1.2: A 0,-1.05; C 0,1.05
HC18U-V = drill 0.813 pad 1.524 round: 1 -2.54,0; 2 2.54,0
R0805 = smd 1.3 x 1.5: 1 -0.95,0; 2 0.95,0
CA6V = drill 1.016 long: A -2.54,-2.54; E 2.54,-2.54; S 0,2.54
RTRIM4G/J = smd 1.3 x 1.3: 1 -1.15,-2.75; 3 1.15,-2.75 | smd 2 x 1.3: 2 0,2.75
TACTILE-PTH = drill 1.016 pad 1.88 round: 1 -3.251,2.261; 2 3.251,2.261; 3 -3.251,-2.261; 4 3.251,-2.261
SWITCH-SPDT-SMD = smd 1.2 x 2.5: 1 -2.5,-2.75; 2 0,-2.75; 3 2.5,-2.75 | hole 0.9: -3.55,0; 3.55,0
EDG-04 = drill 0.813 long: 1 -3.81,-3.81; 2 -1.27,-3.81; 3 1.27,-3.81; 4 3.81,-3.81; 5 3.81,3.81; 6 1.27,3.81; 7 -1.27,3.81; 8 -3.81,3.81
DIL8 = drill 0.813 long: 1 -3.81,-3.81; 2 -1.27,-3.81; 3 1.27,-3.81; 4 3.81,-3.81; 5 3.81,3.81; 6 1.27,3.81; 7 -1.27,3.81; 8 -3.81,3.81
SO-20W = smd 0.762 x 1.143: 1 -5.08,-5.08; 2 -3.81,-5.08; 3 -2.54,-5.08; 4 -1.27,-5.08; 5 0,-5.08; 6 1.27,-5.08; 7 2.54,-5.08; 8 3.81,-5.08; 9 5.08,-5.08; 10 6.35,-5.08; 11 6.35,5.08; 12 5.08,5.08; 13 3.81,5.08; 14 2.54,5.08; 15 1.27,5.08; 16 0,5.08; 17 -1.27,5.08; 18 -2.54,5.08; 19 -3.81,5.08; 20 -5.08,5.08
32005-201 = smd 3.1 x 0.5: 1 3,1.6; 2 3,0.8; 3 3,0; 4 3,-0.8; 5 3,-1.6 | smd 2.5 x 2: M1 -3,-4.45; M2 -3,4.45 | smd 3.3 x 2: M3 2.9,4.45; M4 2.9,-4.45

### Placement (x,y rotation side)
BUZ  101.6,38.1 180 top
C1  63.5,84.07 0 bottom
C2  49.53,50.16 0 top
C3  45.72,40.64 180 bottom
C4  75.56,91.06 180 bottom
C5  74.68,67.94 0 bottom
C6  66.8,65.15 90 bottom
C8  47.62,73.66 180 bottom
C9  49.53,64.14 270 bottom
CON3A  45.09,12.7 90 top
CON3A1  89.53,10.79 270 top
CON3A2  70.48,12.06 90 top
CON3B  47.62,12.7 90 top
CON4A  38.73,10.16 90 top
CON4B  41.27,10.16 90 top
CON5A  32.38,7.62 90 top
CON5B  34.92,7.62 90 top
CON6A  26.04,5.08 90 top
CON6A1  76.83,32.38 270 top
CON6A2  59.69,57.78 0 top
CON6A3  25.83,35.39 270 top
CON6A4  29.21,57.78 0 top
CON6B  28.57,5.08 90 top
I2CA  85.09,40.64 180 top
I2CB  85.09,43.18 180 top
I2CC  85.09,45.72 180 top
IC1  35.56,67.94 270 bottom
IC2  35.56,47.62 270 bottom
J1  44.45,97.16 180 top
JP1  92.71,40.64 0 top
JP2  114.3,37.47 90 top
JP3  74.3,9.53 90 top
JP4  51.44,92.08 0 top
JP5  73.03,73.66 90 top
JP6  95.25,46.99 270 top
JP7  90.17,31.75 0 top
JP8  55.88,84.77 0 top
JP9  97.79,46.99 0 top
JP10  114.3,27.94 180 top
JP11  58.42,84.77 0 top
JP12  110.49,60.33 180 top
JP13  53.34,84.77 0 top
JP14  82.55,52.07 270 top
JP15  80.01,52.07 270 top
JP16  116.84,27.94 0 top
JP17  99.06,91.17 0 top
JP18  10.16,87.63 90 top
JP19  67.31,14.61 270 top
JP20  52.07,14.61 270 bottom
JP21  50.48,79.69 0 top
JP22  85.09,31.75 0 top
JP24  10.16,63.5 90 bottom
JP25  20.32,63.5 270 top
JP26  82.55,31.75 0 top
JP27  79.38,16.51 180 top
JP28  20.32,25.4 90 top
JP29  10.16,25.4 270 bottom
LED1  121.92,30.8 0 top
LED2  121.92,35.24 0 top
LED3  121.92,39.69 0 top
LED4  121.92,44.13 0 top
LED5  121.92,48.58 0 top
LED6  121.92,53.02 0 top
LED7  121.92,57.47 0 top
LED8  121.92,61.91 0 top
LED9  57.78,67.63 90 bottom
LED10  57.15,69.66 90 bottom
Q1  69.34,67.94 0 top
R1  117.47,47.62 0 bottom
R2  117.47,37.47 0 bottom
R3  117.47,40.01 0 bottom
R4  117.47,50.16 0 bottom
R5  117.47,42.55 0 bottom
R6  117.47,45.09 0 bottom
R7  104.14,32.38 270 bottom
R8  106.68,32.38 270 bottom
R9  114.3,32.38 270 bottom
R10  74.93,50.8 270 bottom
R11  77.47,50.8 270 bottom
R12  117.47,52.7 0 bottom
R13  117.47,55.24 0 bottom
R14  109.22,32.38 270 bottom
R15  111.76,32.38 270 bottom
R16  105.41,41.91 270 bottom
R17  61.59,67.63 180 bottom
R18  60.96,69.66 180 bottom
R19  104.14,53.34 180 top
R20  93.98,53.34 180 top
R21  64.78,65.98 90 bottom
R22  95.25,25.4 180 bottom
R25  95.25,27.94 180 bottom
R26  55.56,89.53 180 bottom
R27  75.56,4.45 270 bottom
R28  51.75,89.41 180 bottom
R29  82.55,27.94 0 bottom
R30  82.55,25.4 0 bottom
R31  90.17,83.19 90 bottom
S1  99.69,13.97 0 top
S2  109.22,21.59 0 top
S3  118.75,13.97 0 top
S4  109.22,13.97 0 top
S5  109.22,6.35 0 top
S7  32.38,92.08 0 bottom
SW2  88.9,24.13 0 top
U$1  62.87,24.77 0 bottom
U$3  BREADBOARDMINI  [BREADBOARD-MINI]  28.04,20.32 0 top
U$4  81.92,9.53 90 top
U$5  33.02,24.77 0 top
U$6  63.5,76.83 0 bottom
X1  67.18,90.3 270 bottom

### Tracks (layer width: path | path; a pad name or v marks a point on that pad's centre or on a via)
+3V3
  Bottom 0.61: IC2.3 C3.+
  Bottom 0.813: IC2.3 39.37,40.01 26.67,40.01 | 26.67,40.01 23.5,43.18 23.5,81.92 21.59,83.82 10.48,83.82 8.89,85.41 JP18.2 | CON6A3.1 25.83,39.17 26.67,40.01
  Bottom 1.27: CON6A3.1 CON6A3.2 CON6A3.3 CON6A3.4 CON6A3.5 CON6A3.6
+5V  (via drill 0.8 pad 1.78, 0.8 pad 2.18, 0.9 pad 2.18)
  Top 0.61: v78.11,73.66 v87,79.38
  Top 1.27: v44.45,52.7 v44.45,62.87 | v75.56,57.78 v75.56,73.66
  Bottom 0.406: 92.71,88.9 92.71,91.17
  Bottom 0.61: IC1.3 C9.+ | IC2.1 C2.1 | 92.71,91.17 JP17.2 | 92.71,88.9 90.17,86.36 90.17,83.19 89.02,82.03 R31.1 87.42,79.8 v87,79.38 | v75.56,73.66 v78.11,73.66
  Bottom 0.813: IC1.3 42.55,65.41 41.27,66.67 41.27,73.98 29.84,85.72 24.13,91.44 9.84,91.44 8.89,90.49 JP18.4
  Bottom 1.27: v44.45,52.7 IC2.1 52.07,57.78 CON6A2.1 CON6A2.2 CON6A2.3 CON6A2.4 CON6A2.5 CON6A2.6 v75.56,57.78 | v44.45,62.87 IC1.3 | v75.56,73.66 JP5.1
DATA+
  Bottom 0.406: X1.3 67.18,83.31 67.31,83.19 U$6.19
DATA-
  Bottom 0.406: X1.2 66.38,83.53 66.04,83.19 U$6.18
DB0
  Bottom 0.406: JP17.7 99.06,67.31 92.71,60.96 JP12.8
DB1
  Bottom 0.305: 100.33,88.9 100.33,91.17
  Bottom 0.406: 100.33,91.17 JP17.8 | JP12.7 95.25,60.96 100.33,66.04 100.33,88.9
DB2
  Bottom 0.406: JP12.6 97.79,60.96 101.6,64.77 JP17.9
DB3
  Bottom 0.305: 102.87,88.9 102.87,91.17
  Bottom 0.406: 102.87,91.17 JP17.10 | JP12.5 100.33,60.96 102.87,63.5 102.87,88.9
DB4
  Bottom 0.406: JP12.4 102.87,60.96 104.14,62.23 JP17.11
DB5
  Bottom 0.305: 105.41,88.9 105.41,91.17
  Bottom 0.406: 105.41,91.17 JP17.12 | JP12.3 105.41,88.9
DB6
  Bottom 0.406: JP12.2 107.95,60.96 106.68,62.23 JP17.13
DB7
  Bottom 0.305: 107.95,88.9 107.95,91.17
  Bottom 0.406: 107.95,91.17 JP17.14 | JP12.1 110.49,60.96 107.95,63.5 107.95,88.9
E
  Bottom 0.305: 97.79,88.9 97.79,91.17
  Bottom 0.406: 97.79,91.17 JP17.6 | JP12.9 90.17,60.96 97.79,68.58 97.79,88.9
ENC_A
  Bottom 0.406: JP20.1 52.7,13.97 61.59,13.97 65.41,17.78 69.85,17.78 CON3A2.3
ENC_B
  Bottom 0.406: JP20.2 52.7,12.7 62.23,12.7 66.04,16.51 68.58,16.51 CON3A2.2
ENC_VCC
  Bottom 0.813: JP19.2 CON3A2.1
N$1
  Bottom 0.406: R5.1 120.65,40.32 LED3.A
N$2
  Bottom 0.406: R3.1 120.65,37.78 LED2.A
N$3
  Bottom 0.406: R2.1 118.42,33.02 LED1.A
N$4
  Bottom 0.406: R6.1 119.7,45.09 LED4.A
N$5
  Bottom 0.406: JP2.2 R3.2
N$6
  Bottom 0.406: JP2.3 R5.2
N$7
  Bottom 0.406: JP2.1 R2.2
N$8
  Bottom 0.406: JP2.4 R6.2
N$9
  Bottom 0.406: R17.1 LED9.C
N$10
  Bottom 0.61: R7.2 JP10.5 104.14,22.86 97.51,16.23 S1.1
N$11
  Bottom 0.61: S2.1 105.97,26.59 106.68,27.3 JP10.4 R8.2
N$12
  Bottom 0.61: S4.1 106.4,16.23 108.58,18.41 108.58,26.04 109.22,26.67 JP10.3 R14.2
N$13
  Bottom 0.406: R10.1 74.93,52.7 76.2,53.98 81.28,53.98 82.55,52.7 JP14.1
N$14
  Bottom 0.406: R11.1 78.42,51.75 78.74,52.07 JP15.1
N$15
  Bottom 0.813: JP6.1 93.98,46.99 91.44,49.53 R20.E 93.98,53.34 99.06,53.34 R19.E
N$16
  Bottom 0.61: CON6A.2 CON6B.2
N$17
  Bottom 1.016: BUZ.- R16.2
N$18
  Bottom 0.406: U$6.3 66.04,68.71 Q1.1 C6.2
N$19
  Bottom 0.406: U$6.2 67.31,69.98 69.34,67.94 Q1.2 C5.2
N$20
  Bottom 0.406: LED10.C R18.1
N$21
  Bottom 0.61: CON6A.3 CON6B.3
N$22
  Bottom 0.61: CON6A.4 CON6B.4
N$23
  Bottom 0.61: CON6A.5 CON6B.5
N$24
  Bottom 0.61: CON3A.2 CON3B.2
N$25
  Bottom 0.406: 65.58,89.33 X1.1 | 70.17,73.34 U$6.1 | 70.17,73.34 JP5.2 | C4.1 74.55,91.06 73.61,90.11 | R21.1 63.88,65.03 62.87,66.04 57.78,66.04 56.83,66.99 56.83,67.53 LED9.A 56.73,68.36 56.1,69 LED10.A 54.48,69.66 53.34,70.8 53.34,72.71 53.98,73.34 70.17,73.34
  Bottom 0.813: 65.58,89.33 66.55,90.3 73.41,90.3 73.61,90.11 74.34,89.44 74.93,88.9 74.93,78.11 JP5.2
N$26
  Bottom 0.61: JP16.1 116.84,19.05 118.11,17.78 118.11,14.33 S3.3
  Bottom 0.813: S2.3 103.15,19.33 100.33,16.51 100.33,13.97 | S3.3 115.49,8.18 113.67,6.35 108.23,6.35 S5.3 103.5,6.55 103.5,8.89 105.33,11.35 S4.3 103.71,13.97 100.33,13.97 | 100.33,13.97 98.68,13.97 96.44,11.76 S1.3
N$27
  Bottom 0.61: CON5A.2 CON5B.2
N$28
  Bottom 0.61: CON5A.3 CON5B.3
N$29
  Bottom 0.61: CON5A.4 CON5B.4
N$30
  Bottom 0.305: JP29.1 14.61,43.18 15.88,44.45 20.32,44.45 JP28.29
N$31
  Bottom 0.305: JP29.3 14.61,40.64 15.88,41.91 20.32,41.91 JP28.27
N$32
  Bottom 0.305: JP29.5 14.61,38.1 15.88,39.37 20.32,39.37 JP28.25
N$33
  Bottom 0.305: JP29.7 14.61,35.56 15.88,36.83 20.32,36.83 JP28.23
N$34
  Bottom 0.305: JP29.9 14.61,33.02 15.88,34.29 20.32,34.29 JP28.21
N$35
  Bottom 0.305: JP29.11 14.61,30.48 15.88,31.75 20.32,31.75 JP28.19
N$36
  Bottom 0.305: JP29.13 14.61,27.94 15.88,29.21 20.32,29.21 JP28.17
N$37
  Bottom 0.305: JP29.15 14.61,25.4 15.88,26.67 20.32,26.67 JP28.15
N$38
  Bottom 0.305: JP29.17 14.61,22.86 15.88,24.13 20.32,24.13 JP28.13
N$39
  Bottom 0.305: JP29.19 14.61,20.32 15.88,21.59 20.32,21.59 JP28.11
N$40
  Bottom 0.305: JP29.21 14.61,17.78 15.88,19.05 20.32,19.05 JP28.9
N$41
  Bottom 0.305: JP29.23 14.61,15.24 15.88,16.51 20.32,16.51 JP28.7
N$42
  Bottom 0.305: JP28.5 20.32,13.97 15.88,13.97 14.61,12.7 JP29.25
N$43
  Bottom 0.305: JP28.3 20.32,11.43 15.88,11.43 14.61,10.16 JP29.27
N$44
  Bottom 0.61: JP26.1 81.6,30.8 R29.2
  Bottom 0.813: R30.2 R29.2 | R30.2 81.28,25.4 | R30.2 81.6,23.81 82.3,23.11 95.38,23.11 96.52,24.26 96.52,25.4 R22.2 96.2,27.62 96.52,27.94 R25.2
N$45
  Bottom 0.406: R28.1 50.8,91.31 JP4.1
  Bottom 1.27: S7.2 33.66,89.33 | 33.66,89.33 S7.1 | 33.66,89.33 33.66,87.63 38.73,82.55 43.18,82.55 44.09,83.45 J1.PWR 44.72,83.45 48.9,87.63 48.9,89.53 JP4.1
N$46
  Bottom 0.305: JP28.30 15.88,43.18 14.61,41.91 10.16,41.91 JP29.2
N$47
  Bottom 0.305: JP28.28 15.88,40.64 14.61,39.37 10.16,39.37 JP29.4
N$48
  Bottom 0.305: JP28.26 15.88,38.1 14.61,36.83 10.16,36.83 JP29.6
N$49
  Bottom 0.305: JP28.24 15.88,35.56 14.61,34.29 10.16,34.29 JP29.8
N$50
  Bottom 0.406: U$6.5 63.5,68.58 R17.2
N$51
  Bottom 0.406: R18.2 62.23,69.98 U$6.6
N$52
  Bottom 0.406: C1.1 64.77,84.07 U$6.17
N$53
  Bottom 1.016: JP9.1 R20.S
N$54
  Bottom 1.016: JP9.2 R19.S
N$55
  Bottom 1.27: U$4.7 75.56,8.26 JP3.1
N$56
  Bottom 0.406: U$6.4 R21.2
N$57
  Bottom 0.406: R26.1 R28.2 52.7,88.26 50.48,86.04 JP21.1
N$58
  Bottom 0.406: R4.1 120.65,52.39 LED6.A
N$59
  Bottom 0.406: R1.1 119.7,47.62 LED5.A
N$60
  Bottom 0.406: R12.1 120.65,54.93 LED7.A
N$61
  Bottom 0.406: R13.1 118.42,59.69 LED8.A
N$62
  Bottom 0.406: JP2.6 R4.2
N$63
  Bottom 0.406: JP2.7 R12.2
N$64
  Bottom 0.406: JP2.5 R1.2
N$65
  Bottom 0.406: JP2.8 R13.2
N$66
  Bottom 0.61: S5.1 106.4,8.61 110.49,12.7 110.49,25.4 111.76,26.67 JP10.2 R15.2
N$67
  Bottom 0.61: S3.1 114.86,16.59 114.3,17.14 JP10.1 R9.2
N$68
  Bottom 1.27: U$4.6 79.38,10.79 80.64,12.06 80.64,15.88 80.01,16.51 JP27.1
N$69
  Bottom 0.813: JP7.2 SW2.5 R25.1
N$70
  Bottom 0.813: JP7.1 SW2.6 90.17,26.67 91.44,25.4 R22.1
N$71
  Bottom 0.305: JP29.29 14.61,7.62 15.88,8.89 20.32,8.89 JP28.1
N$72
  Bottom 0.305: JP29.30 10.16,6.35 14.61,6.35 15.88,7.62 JP28.2
N$82
  Bottom 0.305: JP28.22 15.88,33.02 14.61,31.75 10.16,31.75 JP29.10
N$83
  Bottom 1.016: JP1.1 95.25,40.64 BUZ.+
N$85
  Bottom 0.305: JP28.20 15.88,30.48 14.61,29.21 10.16,29.21 JP29.12
N$86
  Bottom 0.305: JP28.18 15.88,27.94 14.61,26.67 10.16,26.67 JP29.14
N$87
  Bottom 0.305: JP28.16 15.88,25.4 14.61,24.13 10.16,24.13 JP29.16
N$88
  Bottom 0.305: JP28.14 15.88,22.86 14.61,21.59 10.16,21.59 JP29.18
N$89
  Bottom 0.305: JP28.12 15.88,20.32 14.61,19.05 10.16,19.05 JP29.20
N$90
  Bottom 0.305: JP28.10 15.88,17.78 14.61,16.51 10.16,16.51 JP29.22
N$91
  Bottom 0.305: JP28.8 15.88,15.24 14.61,13.97 10.16,13.97 JP29.24
N$92
  Bottom 0.305: JP28.6 15.88,12.7 14.61,11.43 10.16,11.43 JP29.26
N$93
  Bottom 0.305: JP28.4 15.88,10.16 14.61,8.89 10.16,8.89 JP29.28
N$96
  Bottom 0.305: JP24.30 14.61,81.28 15.88,82.55 20.32,82.55 JP25.2
N$97
  Bottom 0.305: JP24.28 14.61,78.74 15.88,80.01 20.32,80.01 JP25.4
N$98
  Bottom 0.305: JP24.26 14.61,76.2 15.88,77.47 20.32,77.47 JP25.6
N$99
  Bottom 0.305: JP24.24 14.61,73.66 15.88,74.93 20.32,74.93 JP25.8
N$100
  Bottom 0.305: JP24.22 14.61,71.12 15.88,72.39 20.32,72.39 JP25.10
N$101
  Bottom 0.305: JP24.20 14.61,68.58 15.88,69.85 20.32,69.85 JP25.12
N$102
  Bottom 0.305: JP24.18 14.61,66.04 15.88,67.31 20.32,67.31 JP25.14
N$103
  Bottom 0.305: JP24.16 14.61,63.5 15.88,64.77 20.32,64.77 JP25.16
N$104
  Bottom 0.305: JP24.14 14.61,60.96 15.88,62.23 20.32,62.23 JP25.18
N$105
  Bottom 0.305: JP24.12 14.61,58.42 15.88,59.69 20.32,59.69 JP25.20
N$106
  Bottom 0.305: JP24.10 14.61,55.88 15.88,57.15 20.32,57.15 JP25.22
N$107
  Bottom 0.305: JP24.8 14.61,53.34 15.88,54.61 20.32,54.61 JP25.24
N$108
  Bottom 0.305: JP24.6 14.61,50.8 15.88,52.07 20.32,52.07 JP25.26
N$109
  Bottom 0.305: JP24.4 14.61,48.26 15.88,49.53 20.32,49.53 JP25.28
N$110
  Bottom 0.305: JP24.2 14.61,45.72 15.88,46.99 20.32,46.99 JP25.30
N$112
  Bottom 0.305: JP25.1 15.88,81.28 14.61,80.01 10.16,80.01 JP24.29
N$113
  Bottom 0.305: JP25.3 15.88,78.74 14.61,77.47 10.16,77.47 JP24.27
N$114
  Bottom 0.305: JP25.5 15.88,76.2 14.61,74.93 10.16,74.93 JP24.25
N$115
  Bottom 0.305: JP25.7 15.88,73.66 14.61,72.39 10.16,72.39 JP24.23
N$116
  Bottom 0.305: JP25.9 15.88,71.12 14.61,69.85 10.16,69.85 JP24.21
N$117
  Bottom 0.305: JP25.11 15.88,68.58 14.61,67.31 10.16,67.31 JP24.19
N$118
  Bottom 0.305: JP25.13 15.88,66.04 14.61,64.77 10.16,64.77 JP24.17
N$119
  Bottom 0.305: JP25.15 15.88,63.5 14.61,62.23 10.16,62.23 JP24.15
N$120
  Bottom 0.305: JP25.17 15.88,60.96 14.61,59.69 10.16,59.69 JP24.13
N$121
  Bottom 0.305: JP25.19 15.88,58.42 14.61,57.15 10.16,57.15 JP24.11
N$122
  Bottom 0.305: JP25.21 15.88,55.88 14.61,54.61 10.16,54.61 JP24.9
N$123
  Bottom 0.305: JP25.23 15.88,53.34 14.61,52.07 10.16,52.07 JP24.7
N$124
  Bottom 0.305: JP25.25 15.88,50.8 14.61,49.53 10.16,49.53 JP24.5
N$125
  Bottom 0.305: JP25.27 15.88,48.26 14.61,46.99 10.16,46.99 JP24.3
N$126
  Bottom 0.305: JP25.29 15.88,45.72 14.61,44.45 10.16,44.45 JP24.1
N$128
  Bottom 1.27: U$4.5 75.56,13.34 JP3.2
N$129
  Bottom 0.406: R27.1 75.89,5.71 U$4.8
  Bottom 1.016: CON3A1.3 U$4.1 U$4.8
N$130
  Bottom 1.016: U$4.2 CON3A1.2
N$131
  Bottom 1.016: U$4.4 88.27,13.34 89.53,12.06 CON3A1.1
N$133
  Bottom 0.813: JP22.1 SW2.8 R29.1
N$136
  Bottom 0.813: JP22.2 SW2.7 87.63,26.67 86.36,25.4 R30.1
RS
  Bottom 0.305: 95.25,88.9 95.25,91.17
  Bottom 0.406: 95.25,91.17 JP17.4 | JP12.11 85.09,60.96 95.25,71.12 95.25,88.9
RW
  Bottom 0.406: JP17.5 96.52,69.85 87.63,60.96 JP12.10
RX
  Bottom 0.406: U$6.12 JP11.1
SCL
  Bottom 0.61: I2CB.2 I2CC.2
  Bottom 1.016: I2CA.2 I2CB.2 JP14.2
SDA
  Bottom 0.61: I2CB.3 I2CC.3
  Bottom 1.016: I2CA.3 I2CB.3 JP15.2
SER1
  Bottom 0.61: CON4A.2 CON4B.2
SER2
  Bottom 0.61: CON4A.3 CON4B.3
TX  (via drill 0.8 pad 1.68)
  Top 0.406: v54.86,71.82 v54.86,82.49
  Bottom 0.406: v54.86,82.49 55.88,83.5 JP8.1 | U$6.10 54.93,71.75 v54.86,71.82
V+  (via drill 0.8 pad 1.78, 0.8 pad 2.18)
  Top 1.27: v71.82,32.38 v48.58,70.48
  Bottom 1.016: 44.45,71.12 44.45,73.66 C8.1
  Bottom 1.27: v71.82,32.38 CON6A1.1 CON6A1.2 CON6A1.3 CON6A1.4 CON6A1.5 CON6A1.6 JP27.2 | IC1.1 44.45,71.12 | IC1.1 44.45,73.66 31.79,86.32 29.84,88.27 29.84,89.28 S7.3 | v48.58,70.48 IC1.1
VCC
  Bottom 0.61: R11.2 R10.2
  Bottom 0.813: I2CA.4 I2CB.4 | I2CB.4 I2CC.4 | I2CB.4 R11.2
VO
  Bottom 0.406: R31.2 93.98,84.25 JP17.3
VSS
  Bottom 0.406: X1.5 68.78,82.75 68.58,82.55 U$6.20
  pour Bottom (isolate 0.61): 1.27,95.25 125.73,95.25 125.73,1.27 1.27,1.27
XX1
  Bottom 0.61: CON3A.1 CON3B.1
XX2
  Bottom 0.61: CON4A.1 CON4B.1
XX3
  Bottom 0.61: CON5A.1 CON5B.1
XX4
  Bottom 0.61: CON6A.1 CON6B.1
XX5
  Bottom 0.61: CON3A.3 CON3B.3
XX6
  Bottom 0.61: CON4A.4 CON4B.4
XX7
  Bottom 0.61: CON5A.5 CON5B.5
XX8
  Bottom 0.61: CON6A.6 CON6B.6